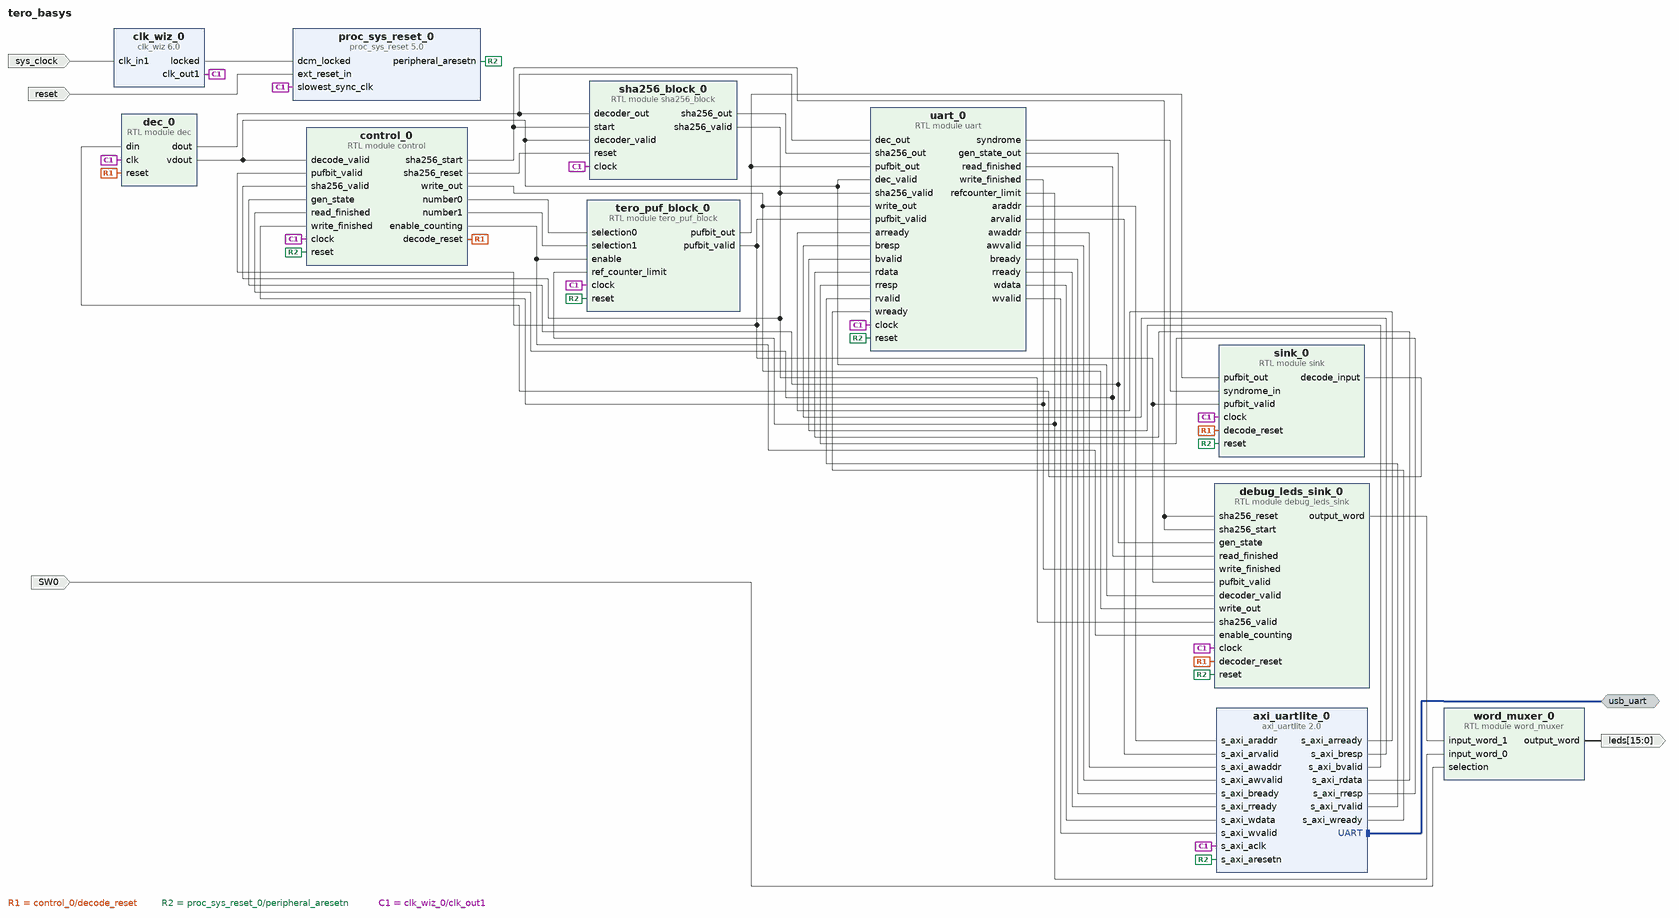
[diagram p0: block diagram of the top level]
# Vivado block design tero_basys, xc7a35tcpg236-1, Vivado 2022.2
create_bd_design tero_basys

create_bd_intf_port -mode Master -vlnv xilinx.com:interface:uart_rtl:1.0 usb_uart
create_bd_port -dir I SW0
create_bd_port -dir O -from 15 -to 0 -type data leds
create_bd_port -dir I -type rst reset
set_property -dict {CONFIG.POLARITY ACTIVE_HIGH} [get_bd_ports reset]
create_bd_port -dir I -type clk sys_clock
set_property -dict {CONFIG.FREQ_HZ 100000000 CONFIG.PHASE 0.000} [get_bd_ports sys_clock]

create_bd_cell -type ip -vlnv xilinx.com:ip:axi_uartlite:2.0 axi_uartlite_0
set_property -dict {CONFIG.C_BAUDRATE 230400} [get_bd_cells axi_uartlite_0]
create_bd_cell -type ip -vlnv xilinx.com:ip:clk_wiz:6.0 clk_wiz_0
set_property -dict [list \
  CONFIG.CLKOUT1_DRIVES BUFG \
  CONFIG.CLKOUT1_JITTER 137.681 \
  CONFIG.CLKOUT1_PHASE_ERROR 105.461 \
  CONFIG.CLKOUT2_DRIVES BUFG \
  CONFIG.CLKOUT3_DRIVES BUFG \
  CONFIG.CLKOUT4_DRIVES BUFG \
  CONFIG.CLKOUT5_DRIVES BUFG \
  CONFIG.CLKOUT6_DRIVES BUFG \
  CONFIG.CLKOUT7_DRIVES BUFG \
  CONFIG.MMCM_BANDWIDTH OPTIMIZED \
  CONFIG.MMCM_CLKFBOUT_MULT_F 9 \
  CONFIG.MMCM_CLKOUT0_DIVIDE_F 9 \
  CONFIG.MMCM_COMPENSATION ZHOLD \
  CONFIG.PRIMITIVE PLL \
] [get_bd_cells clk_wiz_0]
create_bd_cell -type module -reference control control_0
create_bd_cell -type module -reference debug_leds_sink debug_leds_sink_0
create_bd_cell -type module -reference dec dec_0
create_bd_cell -type ip -vlnv xilinx.com:ip:proc_sys_reset:5.0 proc_sys_reset_0
create_bd_cell -type module -reference sha256_block sha256_block_0
create_bd_cell -type module -reference sink sink_0
create_bd_cell -type module -reference uart uart_0
create_bd_cell -type module -reference word_muxer word_muxer_0
create_bd_cell -type module -reference tero_puf_block tero_puf_block_0

# ---- connections ----

connect_bd_intf_net -intf_net axi_uartlite_1_UART [get_bd_intf_ports usb_uart] [get_bd_intf_pins axi_uartlite_0/UART]
connect_bd_net [get_bd_pins control_0/decode_reset] \
  [get_bd_pins dec_0/reset] [get_bd_pins sink_0/decode_reset] [get_bd_pins debug_leds_sink_0/decoder_reset]
connect_bd_net -net SW0_1 [get_bd_ports SW0] [get_bd_pins word_muxer_0/selection]
connect_bd_net -net axi_uartlite_1_s_axi_arready [get_bd_pins axi_uartlite_0/s_axi_arready] [get_bd_pins uart_0/arready]
connect_bd_net -net axi_uartlite_1_s_axi_bresp [get_bd_pins axi_uartlite_0/s_axi_bresp] [get_bd_pins uart_0/bresp]
connect_bd_net -net axi_uartlite_1_s_axi_bvalid [get_bd_pins axi_uartlite_0/s_axi_bvalid] [get_bd_pins uart_0/bvalid]
connect_bd_net -net axi_uartlite_1_s_axi_rdata [get_bd_pins axi_uartlite_0/s_axi_rdata] [get_bd_pins uart_0/rdata]
connect_bd_net -net axi_uartlite_1_s_axi_rresp [get_bd_pins axi_uartlite_0/s_axi_rresp] [get_bd_pins uart_0/rresp]
connect_bd_net -net axi_uartlite_1_s_axi_rvalid [get_bd_pins axi_uartlite_0/s_axi_rvalid] [get_bd_pins uart_0/rvalid]
connect_bd_net -net axi_uartlite_1_s_axi_wready [get_bd_pins axi_uartlite_0/s_axi_wready] [get_bd_pins uart_0/wready]
connect_bd_net -net clk_wiz_1_locked [get_bd_pins clk_wiz_0/locked] [get_bd_pins proc_sys_reset_0/dcm_locked]
connect_bd_net [get_bd_pins control_0/enable_counting] [get_bd_pins debug_leds_sink_0/enable_counting] [get_bd_pins tero_puf_block_0/enable]
connect_bd_net [get_bd_pins control_0/number0] [get_bd_pins tero_puf_block_0/selection0]
connect_bd_net [get_bd_pins control_0/number1] [get_bd_pins tero_puf_block_0/selection1]
connect_bd_net -net control_0_sha_reset [get_bd_pins control_0/sha256_reset] [get_bd_pins sha256_block_0/reset]
connect_bd_net -net control_0_sha_start [get_bd_pins control_0/sha256_start] \
  [get_bd_pins sha256_block_0/start] [get_bd_pins debug_leds_sink_0/sha256_start] \
  [get_bd_pins debug_leds_sink_0/sha256_reset]
connect_bd_net [get_bd_pins control_0/write_out] [get_bd_pins debug_leds_sink_0/write_out] [get_bd_pins uart_0/write_out]
connect_bd_net [get_bd_pins debug_leds_sink_0/output_word] [get_bd_pins word_muxer_0/input_word_1]
connect_bd_net -net decoder_block_0_decoder_out [get_bd_pins dec_0/dout] [get_bd_pins sha256_block_0/decoder_out] [get_bd_pins uart_0/dec_out]
connect_bd_net -net decoder_block_0_decoder_valid [get_bd_pins dec_0/vdout] \
  [get_bd_pins sha256_block_0/decoder_valid] [get_bd_pins control_0/decode_valid] \
  [get_bd_pins debug_leds_sink_0/decoder_valid] [get_bd_pins uart_0/dec_valid]
connect_bd_net [get_bd_pins proc_sys_reset_0/peripheral_aresetn] \
  [get_bd_pins control_0/reset] [get_bd_pins sink_0/reset] [get_bd_pins debug_leds_sink_0/reset] [get_bd_pins uart_0/reset] \
  [get_bd_pins axi_uartlite_0/s_axi_aresetn] [get_bd_pins tero_puf_block_0/reset]
connect_bd_net [get_bd_ports reset] [get_bd_pins proc_sys_reset_0/ext_reset_in]
connect_bd_net -net ro_puf_block_0_pufbit_finished [get_bd_pins tero_puf_block_0/pufbit_valid] \
  [get_bd_pins control_0/pufbit_valid] [get_bd_pins sink_0/pufbit_valid] [get_bd_pins debug_leds_sink_0/pufbit_valid] \
  [get_bd_pins uart_0/pufbit_valid]
connect_bd_net -net ro_puf_block_0_pufbit_out [get_bd_pins tero_puf_block_0/pufbit_out] \
  [get_bd_pins sink_0/pufbit_out] [get_bd_pins uart_0/pufbit_out]
connect_bd_net [get_bd_pins sha256_block_0/sha256_out] [get_bd_pins uart_0/sha256_out]
connect_bd_net [get_bd_pins sha256_block_0/sha256_valid] \
  [get_bd_pins control_0/sha256_valid] [get_bd_pins debug_leds_sink_0/sha256_valid] [get_bd_pins uart_0/sha256_valid]
connect_bd_net [get_bd_pins sink_0/decode_input] [get_bd_pins dec_0/din]
connect_bd_net -net sys_clock_1 [get_bd_pins clk_wiz_0/clk_out1] \
  [get_bd_pins sha256_block_0/clock] [get_bd_pins control_0/clock] [get_bd_pins sink_0/clock] [get_bd_pins dec_0/clk] \
  [get_bd_pins debug_leds_sink_0/clock] [get_bd_pins uart_0/clock] [get_bd_pins axi_uartlite_0/s_axi_aclk] \
  [get_bd_pins proc_sys_reset_0/slowest_sync_clk] [get_bd_pins tero_puf_block_0/clock]
connect_bd_net [get_bd_ports sys_clock] [get_bd_pins clk_wiz_0/clk_in1]
connect_bd_net [get_bd_pins uart_0/araddr] [get_bd_pins axi_uartlite_0/s_axi_araddr]
connect_bd_net [get_bd_pins uart_0/arvalid] [get_bd_pins axi_uartlite_0/s_axi_arvalid]
connect_bd_net [get_bd_pins uart_0/awaddr] [get_bd_pins axi_uartlite_0/s_axi_awaddr]
connect_bd_net [get_bd_pins uart_0/awvalid] [get_bd_pins axi_uartlite_0/s_axi_awvalid]
connect_bd_net [get_bd_pins uart_0/bready] [get_bd_pins axi_uartlite_0/s_axi_bready]
connect_bd_net -net uart_0_provision_out [get_bd_pins uart_0/gen_state_out] \
  [get_bd_pins control_0/gen_state] [get_bd_pins debug_leds_sink_0/gen_state]
connect_bd_net [get_bd_pins uart_0/read_finished] [get_bd_pins control_0/read_finished] [get_bd_pins debug_leds_sink_0/read_finished]
connect_bd_net [get_bd_pins uart_0/refcounter_limit] [get_bd_pins word_muxer_0/input_word_0] [get_bd_pins tero_puf_block_0/ref_counter_limit]
connect_bd_net [get_bd_pins uart_0/rready] [get_bd_pins axi_uartlite_0/s_axi_rready]
connect_bd_net [get_bd_pins uart_0/syndrome] [get_bd_pins sink_0/syndrome_in]
connect_bd_net [get_bd_pins uart_0/wdata] [get_bd_pins axi_uartlite_0/s_axi_wdata]
connect_bd_net [get_bd_pins uart_0/write_finished] [get_bd_pins control_0/write_finished] [get_bd_pins debug_leds_sink_0/write_finished]
connect_bd_net [get_bd_pins uart_0/wvalid] [get_bd_pins axi_uartlite_0/s_axi_wvalid]
connect_bd_net [get_bd_pins word_muxer_0/output_word] [get_bd_ports leds]

validate_bd_design
save_bd_design
